# EAGLE design tengu-rev-1 (EAGLE 4.92)
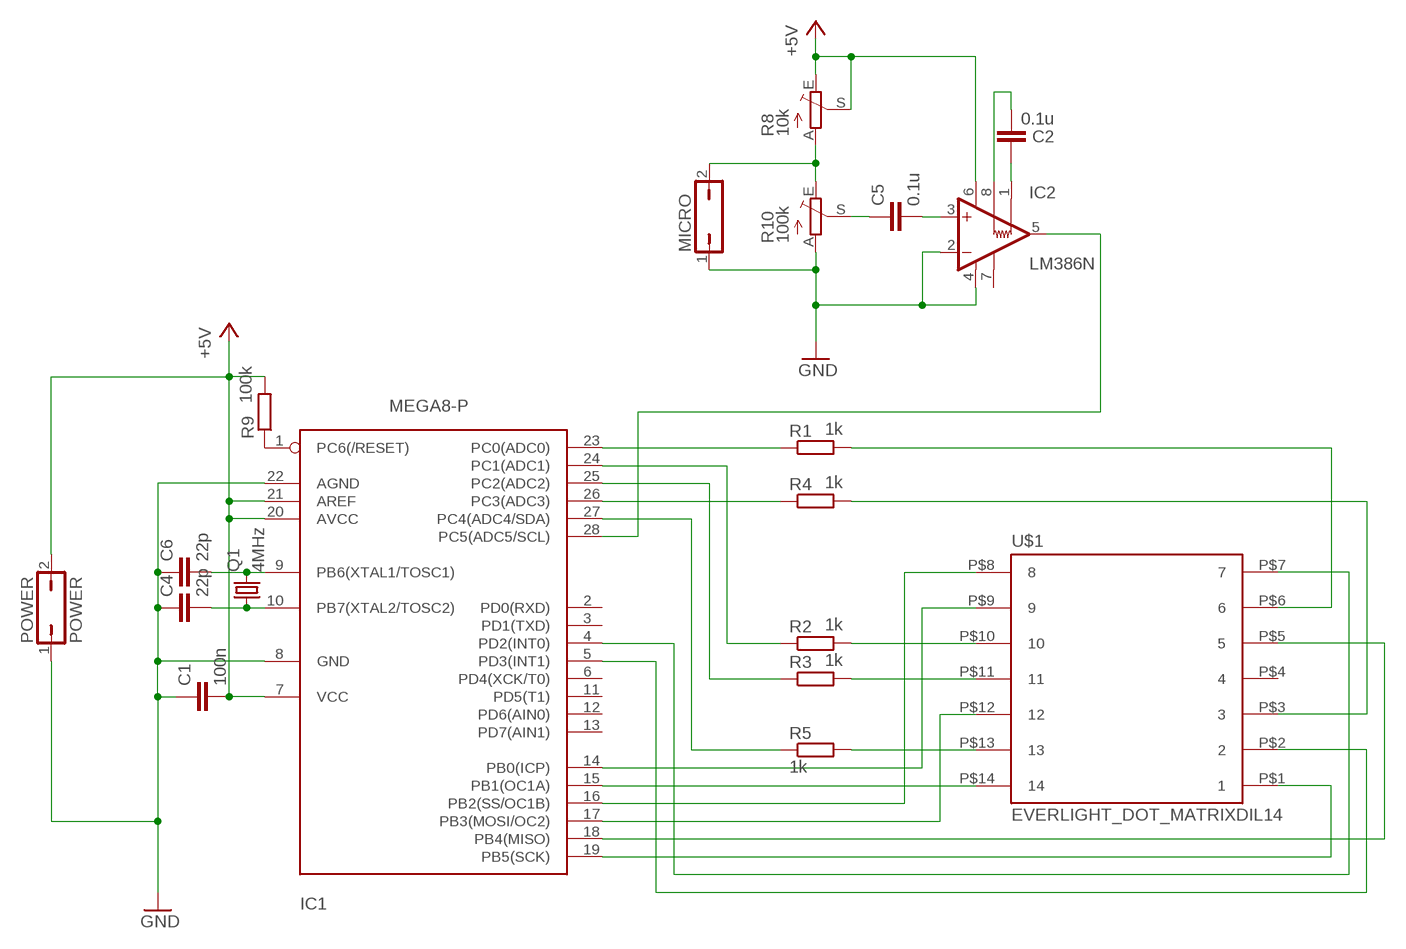
[diagram p0: schematic, sheet 1]

## Parts
C1  100n  C-EU025-025X050  [C025-025X050]
C2  0.1u  C-EU025-024X044  [C025-024X044]
C4  22p  C-EU025-025X050  [C025-025X050]
C5  0.1u  C-EU025-024X044  [C025-024X044]
C6  22p  C-EU025-025X050  [C025-025X050]
IC1  MEGA8-P  [DIL28-3]
IC2  LM386N  [LINEAR_DIL08]
MICRO  JP1Q  [JP1]
POWER  POWER  JP1Q  [JP1]
Q1  4MHz  CRYSTALHC18U-V  [HC18U-V]
R1  1k  R-EU_0207/10  [0207/10]
R2  1k  R-EU_0207/10  [0207/10]
R3  1k  R-EU_0207/10  [0207/10]
R4  1k  R-EU_0207/10  [0207/10]
R5  1k  R-EU_0207/10  [0207/10]
R8  10k  TRIM_EU-CA6V  [CA6V]
R9  100k  R-EU_0207/10  [0207/10]
R10  100k  TRIM_EU-CA6V  [CA6V]
U$1  EVERLIGHT_DOT_MATRIXDIL14  [DOT_MATRIX]

## Nets
+5V: C1.2 IC1.7(VCC) IC1.20(AVCC) IC1.21(AREF) IC2.6(V+) POWER.2 R8.E R8.S R9.2
GND: C1.1 C4.1 C6.1 IC1.8(GND) IC1.22(AGND) IC2.2(-IN) IC2.4(GND) MICRO.1 POWER.1 R10.A
N$1: IC1.23(PC0(ADC0)) R1.1
N$2: R1.2 U$1.P$6
N$3: IC1.24(PC1(ADC1)) R2.1
N$4: R2.2 U$1.P$10
N$5: IC1.25(PC2(ADC2)) R3.1
N$6: R4.2 U$1.P$3
N$7: IC1.26(PC3(ADC3)) R4.1
N$8: R5.2 U$1.P$13
N$9: IC1.27(PC4(ADC4/SDA)) R5.1
N$10: R3.2 U$1.P$11
N$11: IC1.19(PB5(SCK)) U$1.P$1
N$12: IC1.18(PB4(MISO)) U$1.P$5
N$13: IC1.17(PB3(MOSI/OC2)) U$1.P$12
N$14: IC1.4(PD2(INT0)) U$1.P$7
N$15: IC1.5(PD3(INT1)) U$1.P$2
N$16: IC1.14(PB0(ICP)) U$1.P$9
N$17: IC1.15(PB1(OC1A)) U$1.P$14
N$18: IC1.16(PB2(SS/OC1B)) U$1.P$8
N$19: C6.2 IC1.9(PB6(XTAL1/TOSC1)) Q1.2
N$20: C5.2 IC2.3(+IN)
N$21: MICRO.2 R8.A R10.E
N$22: C5.1 R10.S
N$24: C4.2 IC1.10(PB7(XTAL2/TOSC2)) Q1.1
N$26: C2.1 IC2.1(+GAIN)
N$27: IC1.1(PC6(/RESET)) R9.1
N$28: C2.2 IC2.8(-GAIN)
N$31: IC1.28(PC5(ADC5/SCL)) IC2.5(OUT)
Unconnected: IC1.2(PD0(RXD)) IC1.3(PD1(TXD)) IC1.6(PD4(XCK/T0)) IC1.11(PD5(T1)) IC1.12(PD6(AIN0)) IC1.13(PD7(AIN1)) IC2.7(BYPASS) U$1.P$4

## Library data of the parts
C1 C2 C4-C6 = rcl:C-EU: CAPACITOR, European symbol
IC1 = atmel:MEGA8-P: MICROCONTROLLER 8 Kbytes FLASH 1 kbytes SRAM 512 bytes EEPROM USART 4-channel 10 bit ADC 2-channel 8 bit ADC Source: avr.lbr
IC2 = audioamp:LM386: OP AMP
MICRO POWER = jumper:JP1Q: JUMPER
Q1 = crystal:CRYSTAL: CRYSTAL
R1-R5 R9 = rcl:R-EU_: RESISTOR, European symbol
R8 R10 = pot:TRIM_EU-: POTENTIOMETER
U$1 = alex:EVERLIGHT_DOT_MATRIX

## Board
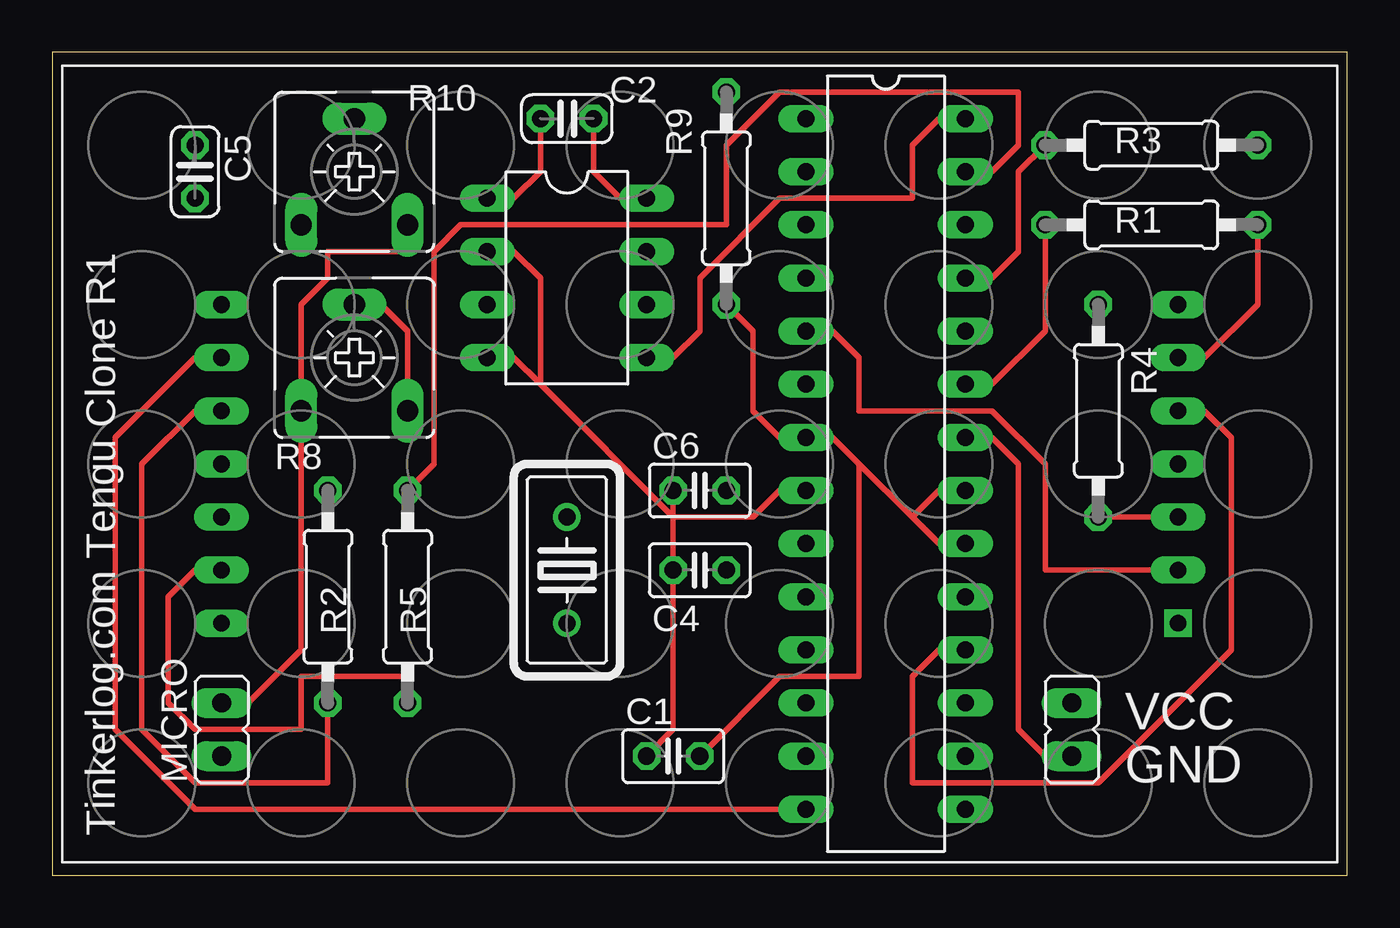
[diagram p1: board, top side]
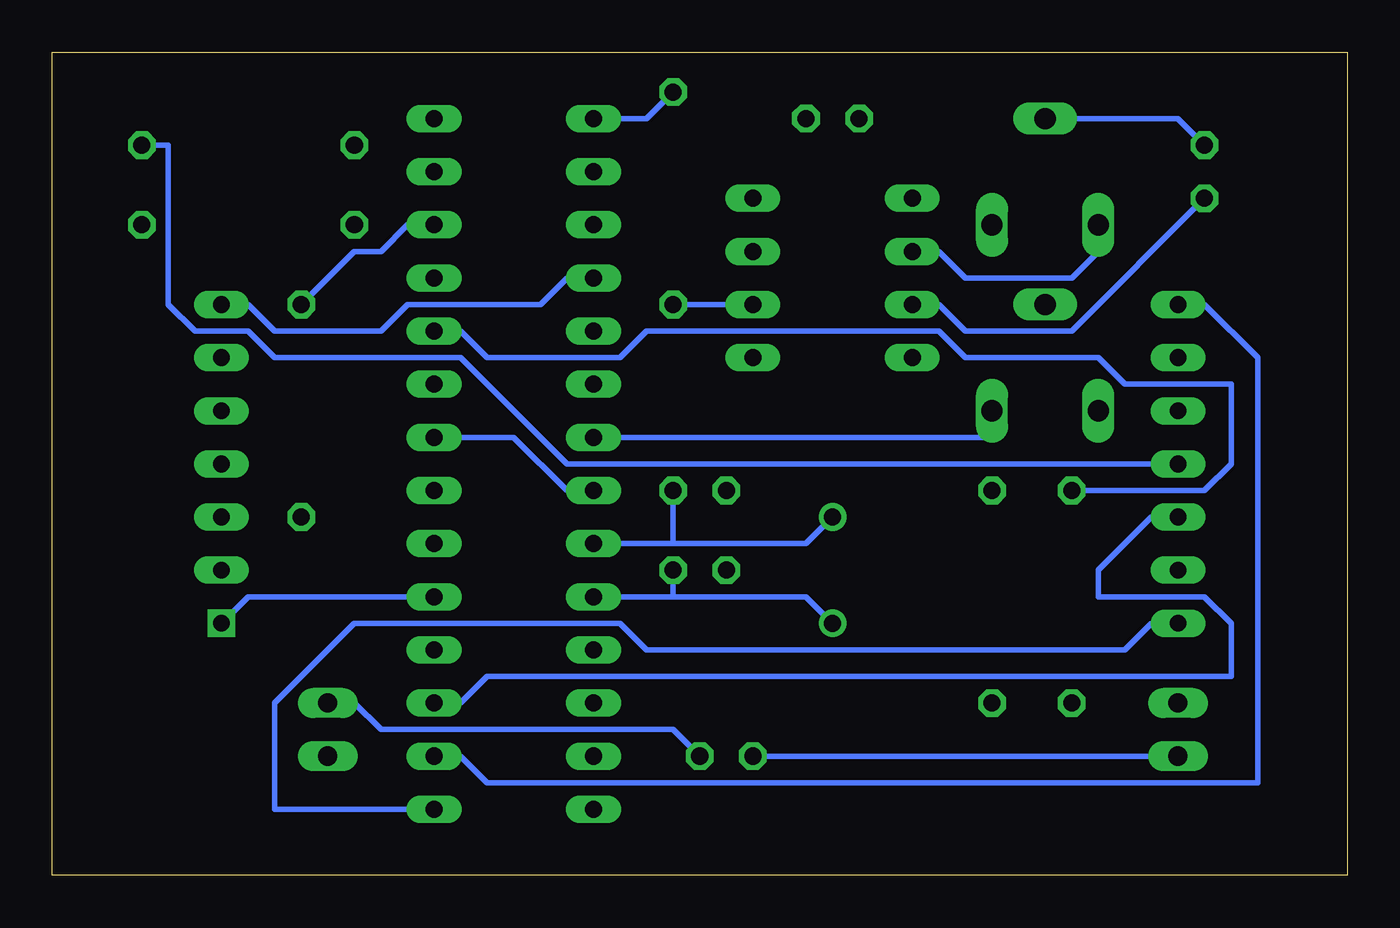
[diagram p2: board, bottom side, seen from below]

Size 61.9 x 39.36 mm. Coordinates in mm from the lower left corner, seen from the top.
Outline: 0,0 61.9,0 61.9,39.36 0,39.36 0,0
Copper layers (1*16): Top 0.035mm / dielectric 1.5mm / Bottom 0.035mm
Design rules "10mils": minimum track width 10mil, minimum drill 24mil, track to track 10mil, track to pad 10mil, pad to pad 10mil, via to via 10mil, smd to smd 10mil, copper to edge 40mil, drill to drill 10mil, minimum pad ring 10mil, minimum via ring 8mil, stop-mask expansion 0mil, vias tented up to drill 0mil, thermal gap 10mil

### Footprints (pad centres in the part's own frame; a part is rotated, then mirrored left to right if it is on the bottom)
C025-025X050 = drill 0.813 octagon: 1 -1.27,0; 2 1.27,0
C025-024X044 = drill 0.813 octagon: 1 -1.27,0; 2 1.27,0
DIL28-3 = drill 0.813 long: 1 -16.51,-3.81; 2 -13.97,-3.81; 3 -11.43,-3.81; 4 -8.89,-3.81; 5 -6.35,-3.81; 6 -3.81,-3.81; 7 -1.27,-3.81; 8 1.27,-3.81; 9 3.81,-3.81; 10 6.35,-3.81; 11 8.89,-3.81; 12 11.43,-3.81; 13 13.97,-3.81; 14 16.51,-3.81; 15 16.51,3.81; 16 13.97,3.81; 17 11.43,3.81; 18 8.89,3.81; 19 6.35,3.81; 20 3.81,3.81; 21 1.27,3.81; 22 -1.27,3.81; 23 -3.81,3.81; 24 -6.35,3.81; 25 -8.89,3.81; 26 -11.43,3.81; 27 -13.97,3.81; 28 -16.51,3.81
LINEAR_DIL08 = drill 0.813 pad 1.321 long: 1 -3.81,-3.81; 2 -1.27,-3.81; 3 1.27,-3.81; 4 3.81,-3.81; 5 3.81,3.81; 6 1.27,3.81; 7 -1.27,3.81; 8 -3.81,3.81
JP1 = drill 0.914 long: 1 0,-1.27; 2 0,1.27
HC18U-V = drill 0.813 round: 1 -2.54,0; 2 2.54,0
0207/10 = drill 0.813 octagon: 1 -5.08,0; 2 5.08,0
CA6V = drill 1.016 long: A -2.54,-2.54; E 2.54,-2.54; S 0,2.54
DOT_MATRIX = drill 0.8 square: P$1 45.72,0 | drill 0.8 long: P$2 45.72,2.54; P$3 45.72,5.08; P$4 45.72,7.62; P$5 45.72,10.16; P$6 45.72,12.7; P$7 45.72,15.24; P$8 0,15.24; P$9 0,12.7; P$10 0,10.16; P$11 0,7.62; P$12 0,5.08; P$13 0,2.54; P$14 0,0

### Placement (x,y rotation side)
C1  29.68,5.71 0 top
C2  24.6,36.19 0 top
C4  30.95,14.6 0 top
C5  6.82,33.65 270 top
C6  30.95,18.41 0 top
IC1  39.84,19.68 270 top
IC2  24.6,28.57 270 top
MICRO  8.09,6.98 0 top
POWER  48.73,6.98 0 top
Q1  24.6,14.6 90 top
R1  52.54,31.11 0 top
R2  13.17,13.33 270 top
R3  52.54,34.92 0 top
R4  50,22.22 270 top
R5  16.98,13.33 270 top
R8  14.44,24.76 0 top
R9  32.22,32.38 270 top
R10  14.44,33.65 0 top
U$1  8.09,12.06 0 top

### Tracks (layer width: path | path; a pad name or v marks a point on that pad's centre or on a via)
+5V
  Top 0.254: R8.S 15.71,27.3 16.98,26.03 R8.E | 41.11,17.14 42.38,15.87 IC1.20 | 38.57,19.68 41.11,17.14 | 38.57,19.68 37.3,20.95 IC1.7 34.76,20.95 33.49,22.22 33.49,26.03 R9.2 | 41.11,17.14 42.38,18.41 IC1.21 | C1.2 34.76,9.52 38.57,9.52 38.57,19.68
  Bottom 0.254: C1.2 32.22,6.98 46.19,6.98 47.46,8.25 POWER.2 | R9.2 IC2.6 | R8.E 16.98,20.95 IC1.7
GND
  Top 0.254: POWER.1 47.46,5.71 46.19,6.98 46.19,19.68 44.92,20.95 IC1.22 | C1.1 29.68,6.98 C4.1 29.68,17.14 | 29.68,17.14 C6.1 | 29.68,17.14 23.33,23.49 | 23.33,23.49 22.06,24.76 IC2.4 | 23.33,23.49 23.33,28.57 22.06,29.84 IC2.2 | 29.68,17.14 33.49,17.14 34.76,18.41 IC1.8
  Bottom 0.254: IC1.8 37.3,18.41 39.84,20.95 IC1.22 | MICRO.1 C1.1 | R10.A 11.9,29.84 13.17,28.57 18.25,28.57 19.52,29.84 IC2.2
N$1
  Top 0.254: R1.1 47.46,26.03 44.92,23.49 IC1.23
N$2
  Top 0.254: R1.2 57.62,27.3 55.08,24.76 U$1.P$6
N$3
  Bottom 0.254: R2.1 6.82,18.41 5.55,19.68 5.55,23.49 10.63,23.49 11.9,24.76 18.25,24.76 19.52,26.03 33.49,26.03 34.76,24.76 41.11,24.76 42.38,26.03 IC1.24
N$4
  Top 0.254: R2.2 13.17,4.44 6.82,4.44 4.28,6.98 4.28,19.68 6.82,22.22 U$1.P$10
N$5
  Top 0.254: R3.1 46.19,33.65 46.19,29.84 44.92,28.57 IC1.25
N$6
  Top 0.254: R4.2 U$1.P$3
N$7
  Bottom 0.254: R4.1 47.46,29.84 46.19,29.84 44.92,31.11 IC1.26
N$8
  Top 0.254: R5.2 16.98,9.52 11.9,9.52 11.9,6.98 6.82,6.98 5.55,8.25 5.55,13.33 6.82,14.6 U$1.P$13
N$9
  Top 0.254: R5.1 18.25,19.68 18.25,29.84 19.52,31.11 32.22,31.11 32.22,34.92 34.76,37.46 46.19,37.46 46.19,34.92 44.92,33.65 IC1.27
N$10
  Bottom 0.254: R3.2 56.35,34.92 56.35,27.3 55.08,26.03 52.54,26.03 51.27,24.76 42.38,24.76 37.3,19.68 U$1.P$11
N$11
  Bottom 0.254: U$1.P$1 52.54,13.33 IC1.19
N$12
  Top 0.254: U$1.P$5 55.08,22.22 56.35,20.95 56.35,10.79 50,4.44 41.11,4.44 41.11,9.52 42.38,10.79 IC1.18
N$13
  Bottom 0.254: U$1.P$12 9.36,17.14 11.9,14.6 11.9,13.33 6.82,13.33 5.55,12.06 5.55,9.52 41.11,9.52 42.38,8.25 IC1.17
N$14
  Bottom 0.254: U$1.P$7 52.54,27.3 51.27,26.03 46.19,26.03 44.92,27.3 38.57,27.3 37.3,28.57 IC1.4
N$15
  Top 0.254: U$1.P$2 47.46,14.6 47.46,19.68 44.92,22.22 38.57,22.22 38.57,24.76 37.3,26.03 IC1.5
N$16
  Top 0.254: U$1.P$9 6.82,24.76 3.01,20.95 3.01,6.98 6.82,3.17 IC1.14
N$17
  Bottom 0.254: U$1.P$14 9.36,12.06 10.63,10.79 33.49,10.79 34.76,12.06 47.46,12.06 51.27,8.25 51.27,3.17 IC1.15
N$18
  Bottom 0.254: U$1.P$8 6.82,27.3 4.28,24.76 4.28,4.44 41.11,4.44 42.38,5.71 IC1.16
N$19
  Bottom 0.254: Q1.2 25.87,15.87 32.22,15.87 | 32.22,15.87 IC1.9 | 32.22,15.87 C6.2
N$20
  Bottom 0.254: C5.2 13.17,26.03 18.25,26.03 19.52,27.3 IC2.3
N$21
  Top 0.254: MICRO.2 9.36,8.25 11.9,10.79 R8.A 11.9,27.3 13.17,28.57 13.17,29.84 16.98,29.84 R10.E
N$22
  Bottom 0.254: C5.1 8.09,36.19 R10.S
N$24
  Bottom 0.254: Q1.1 25.87,13.33 32.22,13.33 | 32.22,13.33 IC1.10 | 32.22,13.33 C4.2
N$26
  Top 0.254: C2.1 23.33,33.65 22.06,32.38 IC2.1
N$27
  Bottom 0.254: R9.1 33.49,36.19 IC1.1
N$28
  Top 0.254: C2.2 25.87,33.65 27.14,32.38 IC2.8
N$31
  Top 0.254: IC2.5 29.68,24.76 30.95,26.03 30.95,28.57 34.76,32.38 41.11,32.38 41.11,34.92 42.38,36.19 IC1.28

### Text on the board
tNames: VCC | GND | Tinkerlog.com Tengu Clone R1